# EAGLE design fanmonitor (EAGLE 6.2)
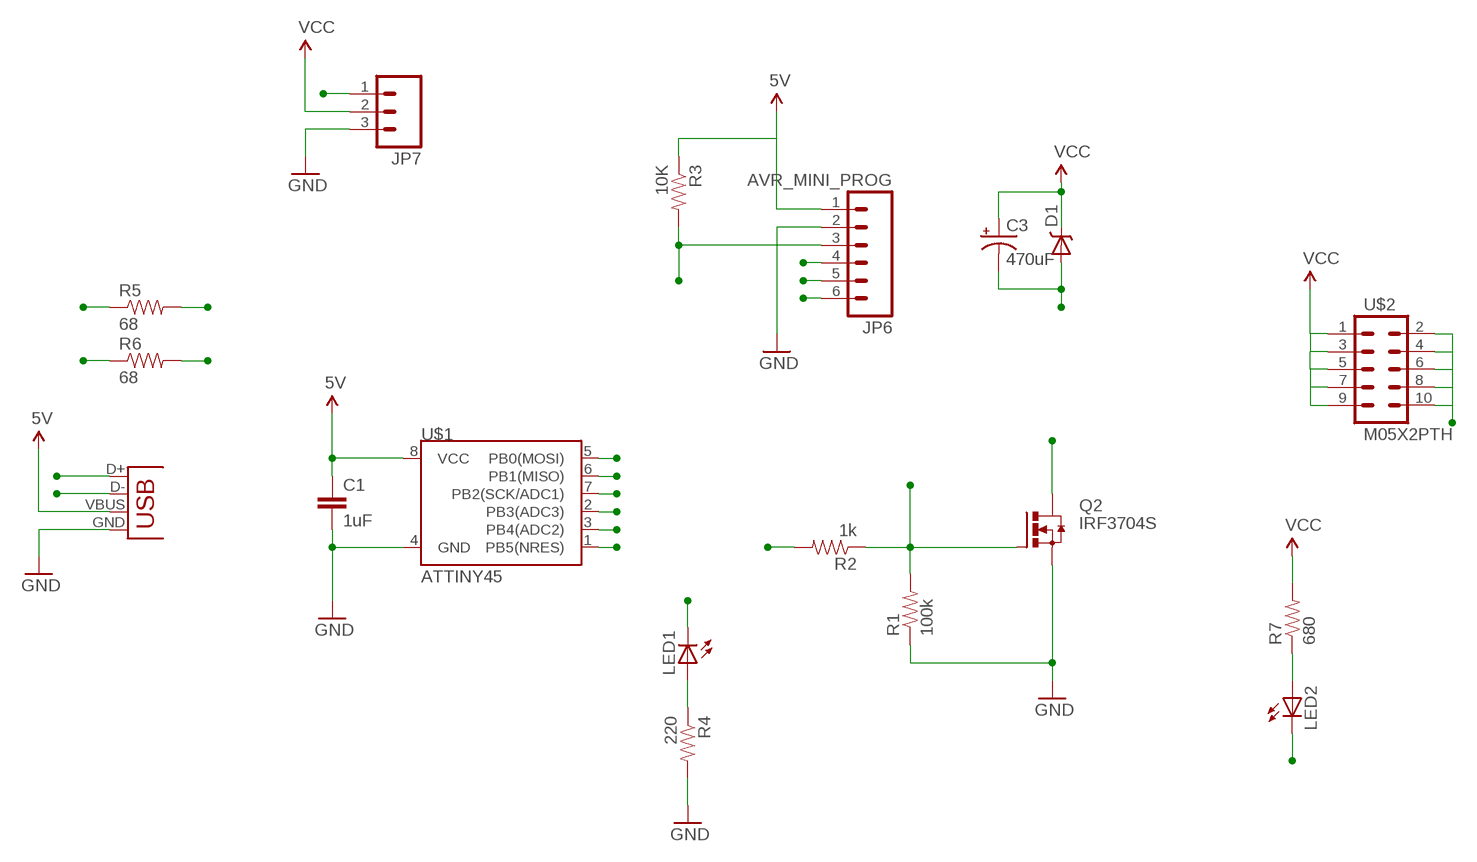
[diagram p0: schematic, sheet 1]

## Parts
C1  1uF  CAP0603-CAP  [0603-CAP]
C3  470uF  CAP_POLD  [PANASONIC_D]
D1  DIODE-SCHOTTKY_  [SMA-DIODE]
JP6  AVR_MINI_PROG  M06SIP  [1X06]
JP7  M03PTH  [1X03]
LED1  LED0603  [LED-0603]
LED2  LED0603  [LED-0603]
Q2  IRF3704S  [D2PACK]
R1  100k  RESISTOR0603-RES  [0603-RES]
R2  1k  RESISTOR0603-RES  [0603-RES]
R3  10K  RESISTOR0603-RES  [0603-RES]
R4  220  RESISTOR0603-RES  [0603-RES]
R5  68  RESISTOR0603-RES  [0603-RES]
R6  68  RESISTOR0603-RES  [0603-RES]
R7  680  RESISTOR0603-RES  [0603-RES]
U$1  ATTINY45  [SO08-EIAJ]
U$2  M05X2PTH  [AVR_ICSP]
X1  USBSMD  [USB-MINIB]

## Nets
5V: C1.1 JP6.1 R3.1 U$1.8(VCC) X1.VBUS
/RST: JP6.3 R3.2 U$1.1(PB5(NRES))
D+: R5.1 X1.D+
D-: R6.1 X1.D-
GND: C1.2 JP6.2 JP7.3 Q2.3(S) R1.1 R4.2 U$1.4(GND) X1.GND
MISO: JP6.6 R6.2 U$1.6(PB1(MISO))
MOSI: JP6.4 R5.2 U$1.5(PB0(MOSI))
N$1: LED1.A R4.1
N$2: LED2.A R7.1
PWM: R2.2 U$1.2(PB3(ADC3))
PWM_OUT: C3.- D1.A LED2.C Q2.2(D) U$2.2 U$2.4 U$2.6 U$2.8 U$2.10
SCK: JP6.5 U$1.7(PB2(SCK/ADC1))
SPD: JP7.1 Q2.1(G) R1.2 R2.1
STAT: LED1.C U$1.3(PB4(ADC2))
VCC: C3.+ D1.C JP7.2 R7.2 U$2.1 U$2.3 U$2.5 U$2.7 U$2.9

## Library data of the parts
C1 = SparkFun-Passives:CAP: Capacitor Standard 0603 ceramic capacitor, and 0.1" leaded capacitor.
C3 = SparkFun-Passives:CAP_POL: Capacitor Polarized These are standard SMD and PTH capacitors. Normally 10uF, 47uF, and 100uF in electrolytic and tantalum varieties. Always verify the external diameter of the through hole cap, it varies with capacity, voltage, and manufacturer. The EIA devices should be standard.
D1 = SparkFun-DiscreteSemi:DIODE-SCHOTTKY: Commonly MBRA140.
JP6 = SparkFun-Connectors:M06: Header 6 Standard 6-pin 0.1" header. Use with straight break away headers (SKU : PRT-00116), right angle break away headers (PRT-00553), swiss pins (PRT-00743), machine pins (PRT-00117), and female headers (PRT-00115). Molex polarized connector foot print use with SKU : PRT-08094 with associated crimp pins and housings. NOTES ON THE VARIANTS LOCK and LOCK_LONGPADS... This footprint was designed to help hold the alignment of a through-hole component (i.e. 6-pin header) while soldering it into place. You may notice that each hole has been shifted either up or down by 0.005 of an inch from it's more standard position (which is a perfectly straight line). This slight alteration caused the pins (the squares in the middle) to touch the edges of the holes. Because they are alternating, it causes a "brace" to hold the component in place. 0.005 has proven to be the perfect amount of "off-center" position when using our standard breakaway headers. Although looks a little odd when you look at the bare footprint, once you have a header in there, the alteration is very hard to notice. Also, if you push a header all the way into place, it is covered up entirely on the bottom side. This idea of altering the position of holes to aid alignment will be further integrated into the Sparkfun Library for other footprints. It can help hold any component with 3 or more connection pins.
JP7 = SparkFun-Connectors:M03: Header 3 Standard 3-pin 0.1" header. Use with straight break away headers (SKU : PRT-00116), right angle break away headers (PRT-00553), swiss pins (PRT-00743), machine pins (PRT-00117), and female headers (PRT-00115). Molex polarized connector foot print use with SKU : PRT-08232 with associated crimp pins and housings.
LED1 LED2 = SparkFun-LED:LED: LEDs Standard schematic elements and footprints for 5mm, 3mm, 1206, and 0603 sized LEDs. 5mm - Spark Fun Electronics SKU : COM-00529 (and others)
Q2 = transistor-power:IRF3704: SMPS MOSFET HEXFET® Power MOSFET Source: http://www.irf.com/product-info/datasheets/data/irf3704.pdf
R1-R7 = SparkFun-Passives:RESISTOR: Resistor Basic schematic elements and footprints for 0603, 1206, and PTH resistors.
U$1 = SparkFun-DigitalIC:ATTINY45: Atmel 8-pin 2/4/8kB flash uC
U$2 = SparkFun-Connectors:M05X2: Header 5x2 Standard 10-pin dual row 0.1" header. Commonly used with AVR-ISP. Use with Spark Fun Electronics SKU: PRT-00778
X1 = SparkFun-Connectors:USB: USB Connectors USB-B-PTH is fully proven SKU : PRT-00139 USB-miniB is fully proven SKU : PRT-00587 USB-A-PCB is untested. USB-A-H is throughly reviewed, but untested. Spark Fun Electronics SKU : PRT-00437 USB-B-SMT is throughly reviewed, but untested. Needs silkscreen touching up. USB-A-S has not been used/tested USB-MB-H has not been used/tested

## Board
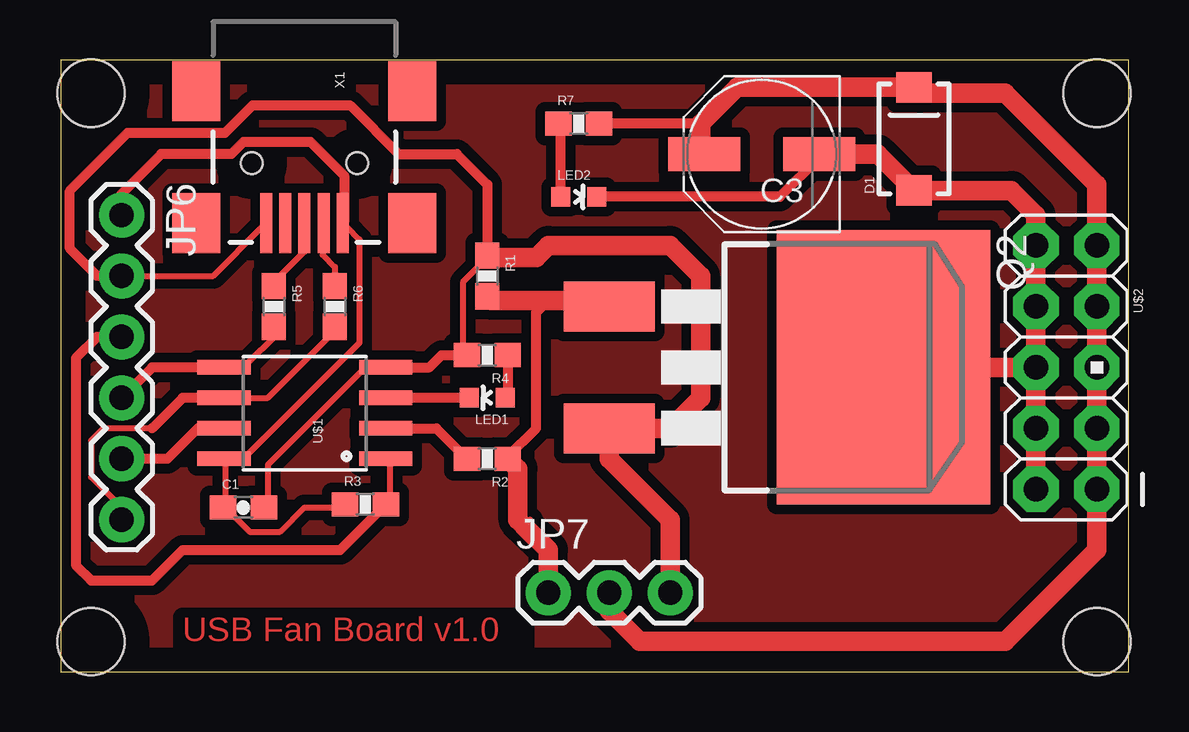
[diagram p1: board, top side]

Size 44.5 x 25.52 mm. Coordinates in mm from the lower left corner, seen from the top.
Outline: 0,0 44.5,0 44.5,25.52 0,25.52 0,0
Copper layers (1*16): Top 0.035mm / dielectric 1.5mm / Bottom 0.035mm
Design rules: minimum track width 10mil, minimum drill 24mil, track to track 8mil, track to pad 8mil, pad to pad 8mil, via to via 8mil, smd to smd 8mil, copper to edge 40mil, drill to drill 8mil, minimum pad ring 10mil, minimum via ring 8mil, stop-mask expansion 4mil, vias tented up to drill 0mil, thermal gap 10mil
Holes 2.8 mm at 1.27,1.27 43.18,1.27 43.18,24.13 1.27,24.13

### Footprints (pad centres in the part's own frame; a part is rotated, then mirrored left to right if it is on the bottom)
0603-CAP = smd 1.1 x 1: 1 -0.85,0; 2 0.85,0
PANASONIC_D = smd 3 x 1.4: + 2.4,0; - -2.4,0
SMA-DIODE = smd 1.27 x 1.47: A -2.15,0; C 2.15,0
1X06 = drill 1.016 pad 1.88: 1 0,0; 2 2.54,0; 3 5.08,0; 4 7.62,0; 5 10.16,0; 6 12.7,0
1X03 = drill 1.016 pad 1.88: 1 0,0; 2 2.54,0; 3 5.08,0
LED-0603 = smd 0.8 x 0.8: A 0,-0.75; C 0,0.75
D2PACK = smd 2.083 x 3.81: 1 -2.54,-8.89; 3 2.54,-8.89 | smd 11.43 x 8.89: 2 0,2.54
0603-RES = smd 1.1 x 1: 1 -0.85,0; 2 0.85,0
SO08-EIAJ = smd 0.61 x 2.21: 1 -1.905,-3.378; 2 -0.635,-3.378; 3 0.635,-3.378; 4 1.905,-3.378; 5 1.905,3.353; 6 0.635,3.353; 7 -0.635,3.353; 8 -1.905,3.353
AVR_ICSP = drill 1.016 pad 1.88 octagon: 1 -1.27,5.08; 2 1.27,5.08; 3 -1.27,2.54; 4 1.27,2.54; 5 -1.27,0; 6 1.27,0; 7 -1.27,-2.54; 8 1.27,-2.54; 9 -1.27,-5.08; 10 1.27,-5.08
USB-MINIB = smd 2.5 x 0.5: D+ 2.5,0; D- 2.5,0.8; GND 2.5,-1.6; ID 2.5,-0.8; VBUS 2.5,1.6 | smd 2.5 x 2: MTN1 -3,4.5; MTN2 2.5,4.5; MTN3 -3,-4.5; MTN4 2.5,-4.5 | hole 0.9: 0,2.2; 0,-2.2

### Placement (x,y rotation side)
C1  7.62,6.86 0 top
C3  29.21,21.59 180 top
D1  35.56,22.23 90 top
JP6  2.54,19.05 270 top
JP7  20.32,3.3 0 top
LED1  17.78,11.43 90 top
LED2  21.59,19.81 270 top
Q2  31.75,12.7 270 top
R1  17.78,16.51 270 top
R2  17.78,8.89 180 top
R3  12.7,6.99 0 top
R4  17.78,13.21 180 top
R5  8.89,15.24 270 top
R6  11.43,15.24 270 top
R7  21.59,22.86 0 top
U$1  10.16,10.79 90 top
U$2  41.91,12.7 180 top
X1  10.16,21.21 270 top

### Tracks (layer width: path | path; a pad name or v marks a point on that pad's centre or on a via)
5V
  Top 0.254: 6.86,8.89 6.86,6.86 | 6.86,6.86 7.87,5.84 9.14,5.84 10.16,6.86 11.68,6.86 R3.1 | 6.86,6.86 C1.1 | 6.86,8.89 7.62,8.89 12.45,13.72 12.45,18.03 11.94,18.54 X1.VBUS | 6.86,8.89 U$1.8
  Top 0.406: 6.77,8.85 U$1.8 | JP6.1 2.54,19.94 4.19,21.59 7.11,21.59 7.62,22.1 10.41,22.1 11.81,20.7 11.81,18.76 X1.VBUS
/RST
  Top 0.254: R3.2 13.72,7.11 13.72,8.89 U$1.1
  Top 0.406: JP6.3 1.52,13.97 0.64,13.08 0.64,4.45 1.27,3.81 3.81,3.81 5.08,5.08 11.64,5.08 R3.2
D+
  Top 0.254: X1.D+ 10.16,17.53 8.89,16.26 R5.1
D-
  Top 0.254: R6.1 11.43,16.89 10.92,17.4 10.92,18.67 X1.D-
GND
  Top 0.254: U$1.4 12.7,12.7 8.64,8.64 8.64,6.86 C1.2 | JP6.2 6.35,16.51 8.38,18.54 X1.GND | 16.76,13.21 16.76,16.26 17.78,17.27 R1.1
  Top 0.406: JP6.2 1.52,16.51 0.38,17.65 0.38,20.07 2.79,22.48 6.86,22.48 8,23.62 12.06,23.62 14.1,21.59 16.51,21.59 17.78,20.32 R1.1 | U$1.4 15.37,12.7 15.88,13.21 16.76,13.21 R4.2
  Top 0.813: JP7.3 25.4,6.35 22.86,8.89 Q2.3 25.4,10.16 26.67,11.43 26.67,16.51 25.4,17.78 20.32,17.78 19.81,17.27 17.78,17.27
MISO
  Top 0.254: U$1.6 8.64,11.43 11.43,14.22 R6.2 | JP6.6 2.54,6.86 1.27,8.13 1.27,9.65 1.78,10.16 3.81,10.16
  Top 0.406: U$1.6 5.08,11.43 3.81,10.16
MOSI
  Top 0.254: R5.2 8.89,14.22 9.14,14.22 7.62,12.7 U$1.5
  Top 0.406: U$1.5 3.81,12.7 JP6.4
N$1
  Top 0.406: R4.1 18.63,11.53 LED1.A
N$2
  Top 0.406: LED2.A 20.84,22.76 R7.1
N$3  (via drill 1.6)
  other vias: 1.27,24.13
N$4  (via drill 1.6)
  other vias: 1.27,1.27
N$5  (via drill 1.6)
  other vias: 43.18,1.27
N$6  (via drill 1.6)
  other vias: 43.18,24.13
N$7
  pour Top (isolate 0.406): 0,0 44.45,0 44.45,25.4 0,25.4
PWM
  Top 0.406: U$1.2 15.66,10.16 R2.2
PWM_OUT
  Top 0.406: C3.- 31.61,21.45 29.97,19.81 LED2.C
  Top 0.813: U$2.6 U$2.8 U$2.10 40.64,19.05 39.62,20.07 D1.A 34.05,21.59 C3.- | U$2.6 U$2.4 U$2.2 | U$2.6 Q2.2
SCK
  Top 0.406: U$1.7 5.71,10.16 4.45,8.89 JP6.5
SPD
  Top 0.254: Q2.1 22.61,15.49 | 17.78,15.49 R1.2 | 19.56,6.35 19.3,6.1
  Top 0.406: R2.1 18.63,8.98 19.81,10.16 19.81,14.99 20.32,15.49
  Top 0.813: JP7.1 20.32,5.08 19.3,6.1 19.05,6.35 19.05,8.47 R2.1 | 22.61,15.49 20.32,15.49 17.95,15.49 R1.2
STAT
  Top 0.406: 13.41,11.43 U$1.3 LED1.C
VCC
  Top 0.406: C3.+ 26.81,22.72 26.67,22.86 R7.2
  Top 0.813: JP7.2 22.86,2.54 24.13,1.27 39.37,1.27 43.18,5.08 U$2.1 U$2.3 U$2.5 U$2.7 U$2.9 43.18,20.32 39.37,24.13 35.8,24.13 D1.C 28.18,24.38 26.67,22.86 26.67,21.73 C3.+

### Text on the board
Top: USB Fan Board v1.0